# EasyEDA Pro project ProPrj_Motor Driver Board v5.3.7.epro, board DRV8874 JST 2P Vertical
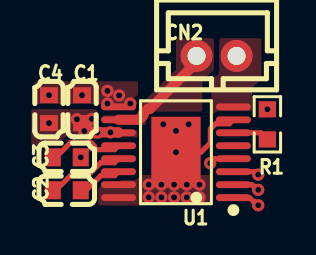
[diagram p4: board, top side]
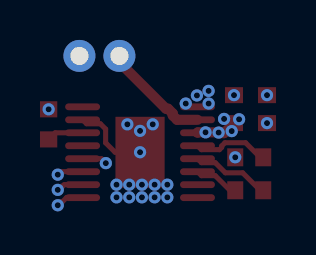
[diagram p5: board, bottom side, seen from below]

No outline. copper layers: Top Layer, Bottom Layer. Coordinates in mm from the lowest, leftmost part position.
Stack: Top Layer 0.035mm / Dielectric1 1.51mm FR4 er 4.5 / Bottom Layer 0.035mm

## Design rules (mm)
template: Custom Config
spacing copperThickness1oz (default): track to track 0.102, other pairs 0.152 to 0.3
spacing copperThickness2oz: track to track 0.203, other pairs 0.152 to 0.3
track width copperThickness1oz (default): min 0.127, default 0.254, max 2.54
track width copperThickness2oz: min 0.203, default 0.254, max 2.54
differential pair differentialPair (default): width min 0.127, default 0.254, max 2.54; gap min 0.152, default 0.152
via viaSize (default): diameter min 0.5, default 0.61, max 10; hole min 0.3, default 0.305, max 6.3

## Placement (name value [footprint] x y rotation side)
C1  100nF  [C0603]  1.65 4.06 90 top
C2  22nF  [C0603]  0.89 0 180 top
C3  100nF  [C0603]  0.89 1.65 0 top
C4  1uF  [C0603]  0 4.06 270 top
CN2  B2B-PH-K-S(LF)(SN)  [CONN-TH_B2B-PH-K-S]  8.38 6.73 0 top
R1  1kΩ  [R0603]  10.92 3.3 270 top
U1  DRV8874PWPR  [HTSSOP-16_L5.0-W4.4-P0.65-LS6.4-BL-EP]  6.35 1.91 90 top

## Footprints (pads in the part's own frame, mm; a bottom-side part is the same pattern mirrored in y, then rotated)
C0603
  rect 0.8x0.9 smd: 1(-0.7,0) 2(0.7,0)
CONN-TH_B2B-PH-K-S
  round 1.6 hole 0.9: 1(1,0) 2(-1,0)
HTSSOP-16_L5.0-W4.4-P0.65-LS6.4-BL-EP
  oval 0.343x1.746 smd: 1(-2.275,-2.873) 2(-1.625,-2.873) 3(-0.975,-2.873) 4(-0.325,-2.873) 5(0.325,-2.873) 6(0.975,-2.873) 7(1.625,-2.873) 8(2.275,-2.873) 9(2.275,2.873) 10(1.625,2.873) 11(0.975,2.873) 12(0.325,2.873) 13(-0.325,2.873) 14(-0.975,2.873) 15(-1.625,2.873) 16(-2.275,2.873)
  rect 3.55x2.46 smd: 17(0,0)
R0603
  rect 0.806x0.864 smd: 1(-0.753,0) 2(0.753,0)

## Nets
As in the schematic.

## Via types
v1: diameter 0.61, hole 0.305, Top Layer to Bottom Layer, 32 vias

## Routing (per net, layer and track width the routed paths; a pad name or vN(x,y) marks a point on that pad's centre or on a via; arc(x,y) is an arc through that point)
GND: length 3.9
  Top Layer w0.254: v1(6.35,1.91) 7.6,1.91 8.07,2.38 8.07,3.07 8.34,3.33 9.02,3.33 U1.7
  vias: v1(0,4.76) v1(1.65,4.76) v1(2.92,4.98) v1(2.92,4.34) v1(3.5,4.75) v1(4.06,4.34) v1(4.99,0.28) v1(4.99,-0.36) v1(5.62,0.28) v1(5.62,-0.36) v1(5.72,3.3) v1(6.26,0.28) v1(6.26,-0.36) v1(6.35,2.97) v1(6.89,0.28) v1(6.89,-0.36) v1(6.99,3.3) v1(7.53,0.28) v1(7.53,-0.36) v1(10.92,4.06)
VBATT: length 2.1
  Top Layer w0.508: C1.1 2.15,2.86 2.3,2.86 2.33,2.89 v1(2.42,2.89) 2.43,2.9 v1(3.07,2.9) 3.46,2.9 3.48,2.88
  vias: v1(0,3.36) v1(1.4,3.56) v1(1.59,1.65) v1(1.77,2.96) v1(2.15,3.57)
EN: length 1.4
  Top Layer w0.254: U1.1 10.03,-0.37 10.22,-0.56 10.28,-0.56 v1(10.47,-0.75)
IPROPI: length 1.8
  Top Layer w0.254: U1.6 10.59,2.88 R1.2
NFAULT: length 1.3
  Top Layer w0.254: U1.4 8.28,1.58 v1(8.06,1.36)
NSLEEP: length 1.3
  Top Layer w0.254: U1.3 10.32,0.93 v1(10.47,0.78)
OUT2: length 5.4
  Top Layer w0.508: 7.57,6.6 5.05,4.09 4.95,4.09 4.71,3.85 4.71,3.75 4.5,3.53 3.48,3.53
PH: length 1.3
  Top Layer w0.254: v1(10.47,0.02) 10.29,0.2 10.22,0.2 10.14,0.28 U1.2
$1N607: length 2.3
  Top Layer w0.254: 3.48,0.93 3.28,0.73 2.59,0.73 1.86,0 C2.1
$1N611: length 3.9
  Top Layer w0.254: C2.2 0.34,0 1.22,0.88 2.08,0.88 2.59,1.38 3.28,1.38 3.48,1.58
$1N695: length 3.9
  Top Layer w0.254: C3.1 0.34,1.65 1.07,2.38 2.1,2.38 2.27,2.22 2.27,2.14 2.38,2.03 3.28,2.03 3.48,2.23

## Copper pours and planes (outline as drawn; the poured copper is in the pictures)
GND on Top Layer: 8.25,0.76 8.25,-0.76 2.47,-0.76 2.47,0.14 2.67,0.76
GND on Top Layer: 2.47,3.94 2.22,4.19 -0.74,4.19 -0.74,5.36 -0.63,5.46 4.46,5.46 4.46,3.94
VBATT on Top Layer: 4.45,3.17 2.54,3.17 2.54,4.06 -0.89,4.06 -0.89,4.06 -0.89,2.29 2.4,2.29 2.41,2.3 2.41,2.54 4.45,2.54
OUT1 on Top Layer: 10.16,3.81 8.12,3.81 8.12,5.56 8.51,5.95 8.51,7.62 10.62,7.62 10.62,5.59 10.16,5.12
OUT2 on Top Layer: 2.67,3.27 5.13,3.27 5.13,3.7 7.67,3.85 7.67,5.46 8.17,5.97 8.25,5.97 8.25,7.62 6.35,7.62 6.35,6.05 4.87,4.57 4.87,4.48 4.48,4.48 4.45,4.45 4.45,4.06 4.19,3.84 2.67,3.84
